# Altium schematic sheet output.SchDoc
size A4
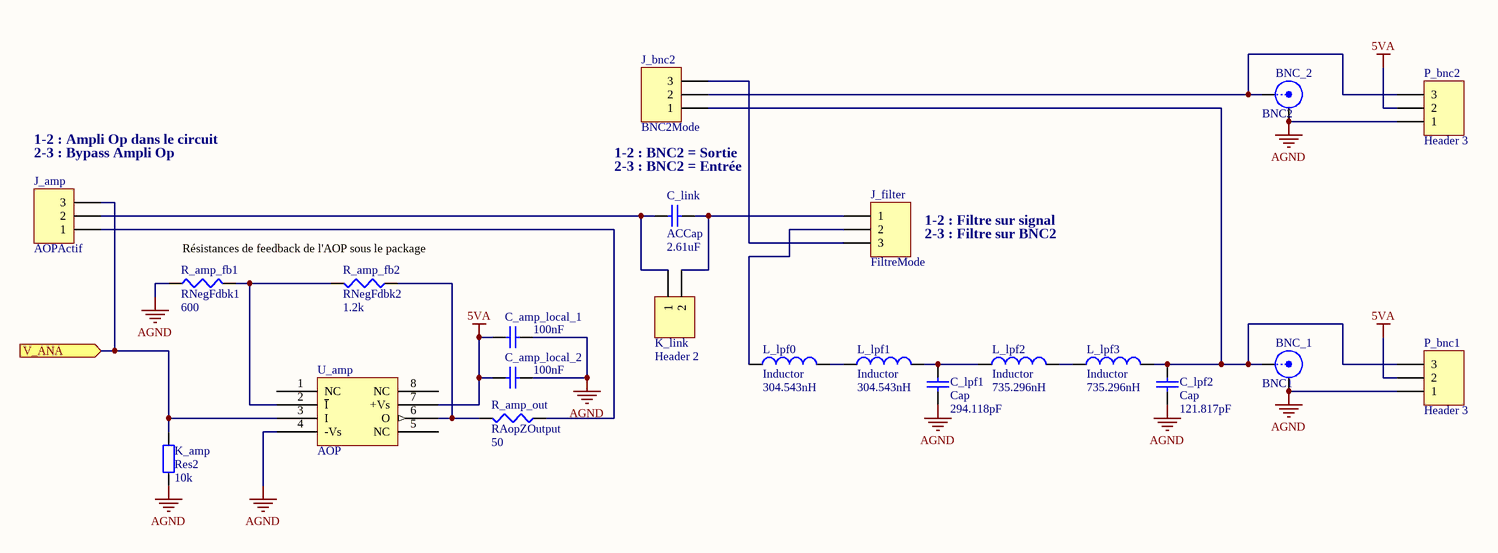
[diagram p0: output.SchDoc]

## Parts
BNC_1  BNC1  [BNC_RA CON]
BNC_2  BNC2  [BNC_RA CON]
C_amp_local_1  value 100nF  [0805]  (hidden comment: Cap Semi)
C_amp_local_2  value 100nF  [0805]  (hidden comment: Cap Semi)
C_link  ACCap  value 2.61uF  [0805]
C_lpf1  Cap  value 294.118pF  [0805]
C_lpf2  Cap  value 121.817pF  [0805]
J_amp  AOPActif  [HDR1X3]
J_bnc2  BNC2Mode  [HDR1X3]
J_filter  FiltreMode  [HDR1X3]
K_amp  Res2  value 10k  [0805]
K_link  Header 2  [HDR1X2]
L_lpf0  Inductor  value 304.543nH  [0805]
L_lpf1  Inductor  value 304.543nH  [0805]
L_lpf2  Inductor  value 735.296nH  [0805]
L_lpf3  Inductor  value 735.296nH  [0805]
P_bnc1  Header 3  [HDR1X3]
P_bnc2  Header 3  [HDR1X3]
R_amp_fb1  RNegFdbk1  value 600  [0805]
R_amp_fb2  RNegFdbk2  value 1.2k  [0805]
R_amp_out  RAopZOutput  value 50  [0805]
U_amp  AOP  [SOIC127P600-8CN]

## Ports
V_ANA (in)

## Nets
5VA: C_amp_local_1.2 C_amp_local_2.2 P_bnc1.2 P_bnc2.2 U_amp.7(+Vs)
AGND: BNC_1.2(Y) BNC_2.2(Y) C_amp_local_1.1 C_amp_local_2.1 C_lpf1.1 C_lpf2.1 K_amp.1 P_bnc1.1 P_bnc2.1 R_amp_fb1.1 U_amp.4(-Vs)
V_ANA: J_amp.3 K_amp.2 U_amp.3(I) ; port V_ANA
NetBNC_1_1: BNC_1.1(X) C_lpf2.2 J_bnc2.1 L_lpf3.2 P_bnc1.3
NetBNC_2_1: BNC_2.1(X) J_bnc2.2 P_bnc2.3
NetC_link_1: C_link.1 J_amp.2 K_link.1
NetC_link_2: C_link.2 J_filter.1 K_link.2
NetC_lpf1_2: C_lpf1.2 L_lpf1.2 L_lpf2.1
NetJ_amp_1: J_amp.1 R_amp_out.1
NetJ_bnc2_3: J_bnc2.3 J_filter.3
NetJ_filter_2: J_filter.2 L_lpf0.1
NetL_lpf0_2: L_lpf0.2 L_lpf1.1
NetL_lpf2_2: L_lpf2.2 L_lpf3.1
NetR_amp_fb1_2: R_amp_fb1.2 R_amp_fb2.2 U_amp.2(~{I})
NetR_amp_fb2_1: R_amp_fb2.1 R_amp_out.2 U_amp.6(O)

Not connected (* = marked no-connect by the designer): U_amp 1(NC) 5(NC) 8(NC)

## Notes on the sheet
- 1-2 : Ampli Op dans le circuit
- (near J_amp) 2-3 : Bypass Ampli Op
- 1-2 : BNC2 = Sortie
- 2-3 : BNC2 = Entrée
- Résistances de feedback de l'AOP sous le package
- 1-2 : Filtre sur signal
- 2-3 : Filtre sur BNC2

## Library data of the parts
BNC_1 BNC_2 = BNC: BNC Elbow Connector; LatestRevisionDate: 17-Jul-2002; LatestRevisionNote: Re-released for DXP Platform.; Publisher: Altium Limited
C_amp_local_1 C_amp_local_2 = Cap Semi: Capacitor (Semiconductor SIM Model); Published: 8-Jun-2000; LatestRevisionDate: 29-May-2009; LatestRevisionNote: IPC-7351 Footprint Added.; PackageReference: C1206; Publisher: Altium Limited; PackageDescription: Chip Capacitor
C_link C_lpf1 C_lpf2 = Cap: Capacitor; Published: 8-Jun-2000; LatestRevisionDate: 17-Jul-2002; LatestRevisionNote: Re-released for DXP Platform.; PackageReference: RAD-0.3; Publisher: Altium Limited
J_amp J_bnc2 J_filter P_bnc1 P_bnc2 = Header 3: Header, 3-Pin; LatestRevisionDate: 17-Jul-2002; LatestRevisionNote: Re-released for DXP Platform.; Publisher: Altium Limited
K_amp = Res2: Resistor; Published: 8-Jun-2000; LatestRevisionDate: 17-Jul-2002; LatestRevisionNote: Re-released for DXP Platform.; PackageReference: AXIAL-0.4; Publisher: Altium Limited
K_link = Header 2: Header, 2-Pin; LatestRevisionDate: 17-Jul-2002; LatestRevisionNote: Re-released for DXP Platform.; Publisher: Altium Limited
L_lpf0-L_lpf3 = Inductor: Code_IEC: 1005; Published: 8-Jun-2000; LatestRevisionDate: 29-May-2009; LatestRevisionNote: IPC-7351 Footprint Added.; PackageReference: 0402-A; Publisher: Altium Limited; PackageDescription: Chip Inductor; Code_JEITA: 0402
R_amp_fb1 R_amp_fb2 R_amp_out = Res3: Resistor; Published: 8-Jun-2000; LatestRevisionDate: 29-May-2009; LatestRevisionNote: IPC-7351 Footprint Added.; PackageReference: J1-0603; Publisher: Altium Limited; PackageDescription: Chip Resistor